# Altium schematic sheet Affichages.SchDoc
size Letter; Organization: Cegep Limoilou; Address1: 1300, 8e Avenue; Address2: Québec, QC; Address3: Canada; Address4: G1J 5L5; Revision: Révision?; SheetNumber: 1; SheetTotal: 2; Conception: Conception?; Titre: Titre?; Modification: Modification?; SPICEModelCacheSUUBYXOL: <root> / <DocumentId>SUUBYXOL</DocumentId> / <CacheFrame Number="0"> / <Model Name="2n3904" Kind="MDL"> / <Text>*2N3904 / *Si 310mW  40V 200mA 300MHz pkg:TO-92B 1,2,3 / .MODEL 2N3904 NPN(IS=1.4E-14 BF=300 VAF=100 IKF=0.025 ISE=3E-13 / + BR=7.5 RC=2.4 CJE=4.5E-12 TF=4E-10 CJC=3.5E-12 TR=2.1E-8 XTB=1.5 KF=9E-16 )</Text> / </Model> / </CacheFrame> / </root>
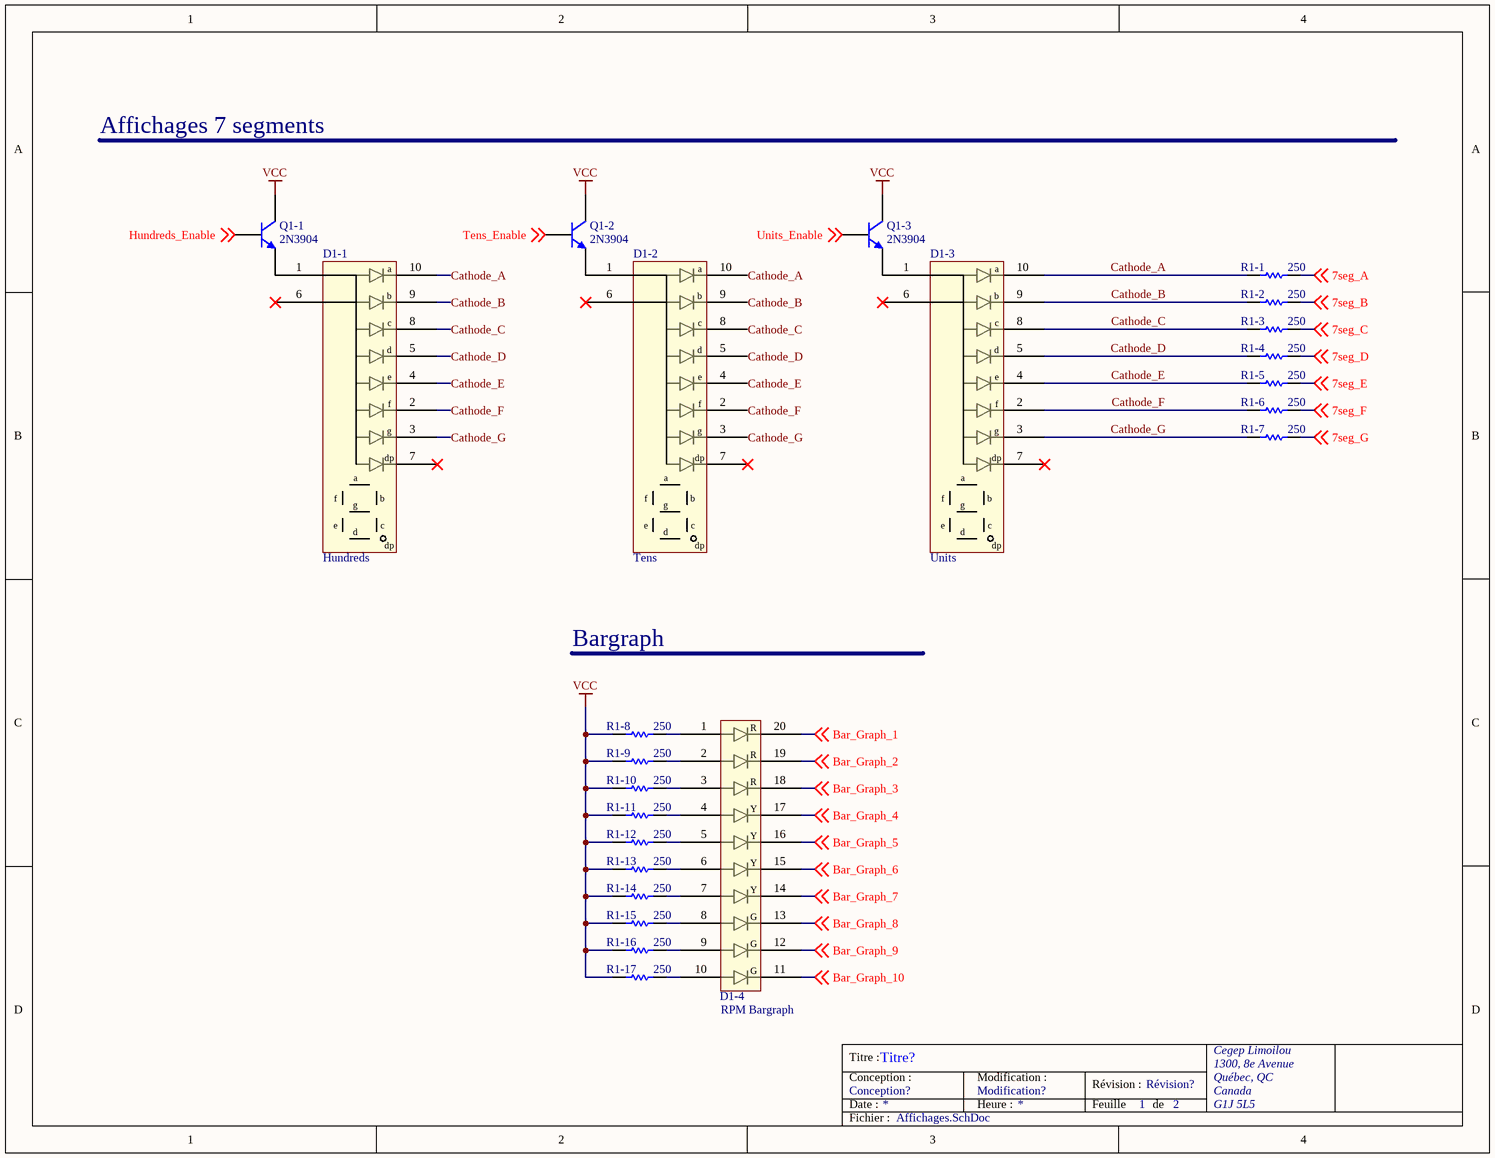
[diagram p0: Affichages.SchDoc]

## Parts
D1-1  Hundreds  [LED_7SEG_LSHD-A101]
D1-2  Tens  [LED_7SEG_LSHD-A101]
D1-3  Units  [LED_7SEG_LSHD-A101]
D1-4  RPM Bargraph  [LED_BARGRAPH-HDSP-4832]
Q1-1  2N3904  [TO-92A]
Q1-2  2N3904  [TO-92A]
Q1-3  2N3904  [TO-92A]
R1-1  value 250  [AXIAL-0.3]  (hidden comment: Res1)
R1-2  value 250  [AXIAL-0.3]  (hidden comment: Res1)
R1-3  value 250  [AXIAL-0.3]  (hidden comment: Res1)
R1-4  value 250  [AXIAL-0.3]  (hidden comment: Res1)
R1-5  value 250  [AXIAL-0.3]  (hidden comment: Res1)
R1-6  value 250  [AXIAL-0.3]  (hidden comment: Res1)
R1-7  value 250  [AXIAL-0.3]  (hidden comment: Res1)
R1-8  value 250  [AXIAL-0.3]  (hidden comment: Res1)
R1-9  value 250  [AXIAL-0.3]  (hidden comment: Res1)
R1-10  value 250  [AXIAL-0.3]  (hidden comment: Res1)
R1-11  value 250  [AXIAL-0.3]  (hidden comment: Res1)
R1-12  value 250  [AXIAL-0.3]  (hidden comment: Res1)
R1-13  value 250  [AXIAL-0.3]  (hidden comment: Res1)
R1-14  value 250  [AXIAL-0.3]  (hidden comment: Res1)
R1-15  value 250  [AXIAL-0.3]  (hidden comment: Res1)
R1-16  value 250  [AXIAL-0.3]  (hidden comment: Res1)
R1-17  value 250  [AXIAL-0.3]  (hidden comment: Res1)

## Nets
VCC: Q1-1.3(C) Q1-2.3(C) Q1-3.3(C) R1-8.2 R1-9.2 R1-10.2 R1-11.2 R1-12.2 R1-13.2 R1-14.2 R1-15.2 R1-16.2 R1-17.2
7seg_A: R1-1.2 ; off-sheet 7seg_A
7seg_B: R1-2.2 ; off-sheet 7seg_B
7seg_C: R1-3.2 ; off-sheet 7seg_C
7seg_D: R1-4.2 ; off-sheet 7seg_D
7seg_E: R1-5.2 ; off-sheet 7seg_E
7seg_F: R1-6.2 ; off-sheet 7seg_F
7seg_G: R1-7.2 ; off-sheet 7seg_G
Bar_Graph_1: D1-4.20(K_A) ; off-sheet Bar_Graph_1
Bar_Graph_2: D1-4.19(K_B) ; off-sheet Bar_Graph_2
Bar_Graph_3: D1-4.18(K_C) ; off-sheet Bar_Graph_3
Bar_Graph_4: D1-4.17(K_D) ; off-sheet Bar_Graph_4
Bar_Graph_5: D1-4.16(K_E) ; off-sheet Bar_Graph_5
Bar_Graph_6: D1-4.15(K_F) ; off-sheet Bar_Graph_6
Bar_Graph_7: D1-4.14(K_G) ; off-sheet Bar_Graph_7
Bar_Graph_8: D1-4.13(K_H) ; off-sheet Bar_Graph_8
Bar_Graph_9: D1-4.12(K_I) ; off-sheet Bar_Graph_9
Bar_Graph_10: D1-4.11(K_J) ; off-sheet Bar_Graph_10
Cathode_A: D1-1.10(K_A) D1-2.10(K_A) D1-3.10(K_A) R1-1.1
Cathode_B: D1-1.9(K_B) D1-2.9(K_B) D1-3.9(K_B) R1-2.1
Cathode_C: D1-1.8(K_C) D1-2.8(K_C) D1-3.8(K_C) R1-3.1
Cathode_D: D1-1.5(K_D) D1-2.5(K_D) D1-3.5(K_D) R1-4.1
Cathode_E: D1-1.4(K_E) D1-2.4(K_E) D1-3.4(K_E) R1-5.1
Cathode_F: D1-1.2(K_F) D1-2.2(K_F) D1-3.2(K_F) R1-6.1
Cathode_G: D1-1.3(K_G) D1-2.3(K_G) D1-3.3(K_G) R1-7.1
Hundreds_Enable: Q1-1.2(B) ; off-sheet Hundreds_Enable
Tens_Enable: Q1-2.2(B) ; off-sheet Tens_Enable
Units_Enable: Q1-3.2(B) ; off-sheet Units_Enable
NetD1-1_1: D1-1.1(ANODE) Q1-1.1(E)
NetD1-2_1: D1-2.1(ANODE) Q1-2.1(E)
NetD1-3_1: D1-3.1(ANODE) Q1-3.1(E)
NetD1-4_1: D1-4.1(AN_A) R1-8.1
NetD1-4_2: D1-4.2(AN_B) R1-9.1
NetD1-4_3: D1-4.3(AN_C) R1-10.1
NetD1-4_4: D1-4.4(AN_D) R1-11.1
NetD1-4_5: D1-4.5(AN_E) R1-12.1
NetD1-4_6: D1-4.6(AN_F) R1-13.1
NetD1-4_7: D1-4.7(AN_G) R1-14.1
NetD1-4_8: D1-4.8(AN_H) R1-15.1
NetD1-4_9: D1-4.9(AN_I) R1-16.1
NetD1-4_10: D1-4.10(AN_J) R1-17.1

Not connected (* = marked no-connect by the designer): D1-1 6(ANODE)* 7(K_H)*; D1-2 6(ANODE)* 7(K_H)*; D1-3 6(ANODE)* 7(K_H)*

## Notes on the sheet
- Affichages 7 segments
- Bargraph
- Titre :
- Conception :
- Date :
- Modification :
- Heure :
- Révision :
- Feuille
- de
- Fichier :
- (in symbol LED_7SEG_LSHD-A101) a; b; c; d; e; f; g; dp
- (in symbol LED_BARGRAPH_HDSP-4832) R; Y; G

## Library data of the parts
D1-1-D1-3 = LED_7SEG_LSHD-A101: LED 7 segment display; Mfg: Lite-On; Mfg_PN: LSHD-A101; Supplier1: Digikey; Supplier1_PN: 160-1572-5-ND
D1-4 = LED_BARGRAPH_HDSP-4832: LED bargraph; Mfg: Broadcom; Mfg_PN: HDSP-4832; Supplier1: Digikey; Supplier1_PN: 516-1236-5-ND
Q1-1-Q1-3 = 2N3904: NPN General Purpose Amplifier; Published: 8-Jun-2000; LatestRevisionDate: 15-Jan-2003; LatestRevisionNote: PCB Footprint 'BCY-W3/D4.7' replaced; DatasheetVersion: 1997; PackageVersion: Sep-1998; PackageReference: TO-92A; Publisher: Altium Limited; PackageDescription: TO, Flat Index; 3 In-Line, Axial Leads; Body Dia. 4.5mm; Leads 0.51 x 0.48 mm (max); ComponentLink1Description: Manufacturer Link; ComponentLink1URL: http://www.fairchildsemi.com/; ComponentLink2Description: Datasheet; ComponentLink2URL: http://www.fairchildsemi.com/ds/2N%2F2N3904.pdf
R1-1-R1-17 = Res1: Resistor; Published: 8-Jun-2000; LatestRevisionDate: 17-Jul-2002; LatestRevisionNote: Re-released for DXP Platform.; PackageReference: AXIAL-0.3; Publisher: Altium Limited; PackageDescription: Axial Device, Thru-Hole; 2 Leads; 0.3 in Pin Spacing